# EAGLE schematic MP1584cir (EAGLE 9.3.0)
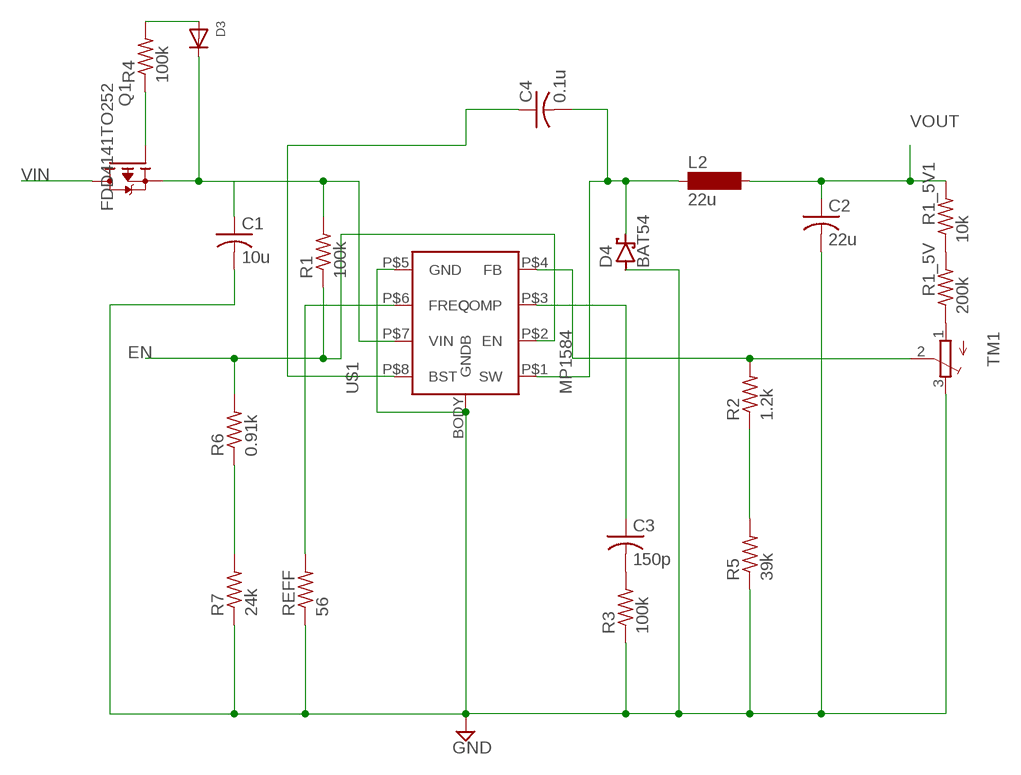
[diagram p0: schematic, sheet 1]

## Parts
C1  10u  C-USC0805  [C0805]
C2  22u  C-USC0805  [C0805]
C3  150p  C-USC0805  [C0805]
C4  0.1u  C-USC0805  [C0805]
D3  DIODESOD-523  [SOD-523]
D4  BAT54  [SOT23]
L2  22u  SM-NE45  [SM-NE45]
Q1  FDD4141TO252  [TO252]
R1  100k  R-US_M0805  [M0805]
R1_5V  200k  R-US_M0805  [M0805]
R1_5V1  10k  R-US_M0805  [M0805]
R2  1.2k  R-US_M0805  [M0805]
R3  100k  R-US_M0805  [M0805]
R4  100k  R-US_M0805  [M0805]
R5  39k  R-US_M0805  [M0805]
R6  0.91k  R-US_M0805  [M0805]
R7  24k  R-US_M0805  [M0805]
REFF  56  R-US_M0805  [M0805]
TM1  TRIMPOTTC33X  [TC33X]
U$1  MP1584  [MP]

## Nets
EN: R1.1 R6.2 U$1.P$2(EN)
GND: C1.2 C2.2 D4.1(A) R3.1 R5.1 R7.1 REFF.1 TM1.3(E) U$1.BODY(GNDB) U$1.P$5(GND)
N$1: REFF.2 U$1.P$6(FREQ)
N$2: C4.2 D4.3(C) L2.1 U$1.P$1(SW)
N$3: C4.1 U$1.P$8(BST)
N$4: R1_5V.1 TM1.1(A)
N$5: C3.2 R3.2
N$6: Q1.1(G) R4.1
N$7: R2.1 R5.2
N$8: D3.A R4.2
N$9: R6.1 R7.2
N$10: R1_5V1.1 R1_5V.2
N$11: C3.1 U$1.P$3(COMP)
P$1: C1.1 D3.K(C) Q1.2(S) R1.2 U$1.P$7(VIN)
V5: R2.2 TM1.2(S) U$1.P$4(FB)
VIN: Q1.3(D)
VOUT: C2.1 L2.2 R1_5V1.2

## Library data of the parts
C1-C4 = adafruit:C-US: CAPACITOR, American symbol
D3 = adafruit:DIODE: Diode SMADIODE - SMA Surface Mount Package 20V 1A Schottky Diode Digikey: 641-1014-6-ND DO-1N4148 - Through Hole Small Current Diode SOD-123 20V 1 A (.5mV Vf) Schottky Diode - Digikey: MBRX120TPMSCT-ND SOD-323 10V 570mA (.38mV Vf, 3ns) Schottky Diode - Digikey: ZLLS410CT-ND SOD-523 30V 30mA Schottky Diode (RB751S-40TE61) - Digikey: RB751S-40TE61CT-ND SOT23-R/W - SOT23 Package (R = Solder Paste/Reflow Ovens, W = Hand-Soldering) BAT54Film 40V 300mA - Digikey: 497-7162-1-ND
D4 = diode:BAT54: Schottky Diodes Source: Fairchild .. BAT54.pdf
L2 = inductor-neosid:SM-NE45: INDUCTOR SMD chip inductor; OC_FARNELL: unknown; OC_NEWARK: unknown
Q1 = transistor-fet:FDD4141: P-Channel PowerTrench® MOSFET Source: FDD4141.pdf
R1 R1_5V R1_5V1 R2 R3 R5-R7 REFF = adafruit:R-US_: RESISTOR, American symbol
R4 = rcl:R-US_: RESISTOR, American symbol; SPICEPREFIX: R
TM1 = adafruit:TRIMPOT: SMT trimmer potentiometer part number TC33X http://www.ladyada.net/library/eagle
U$1 = mp1584S:MP1584

## Net classes
0 default: width 0.305 mm, drill 0.508 mm, clearance 0.254 mm